# EAGLE design main-stm-02.2 (EAGLE 7.6.0)
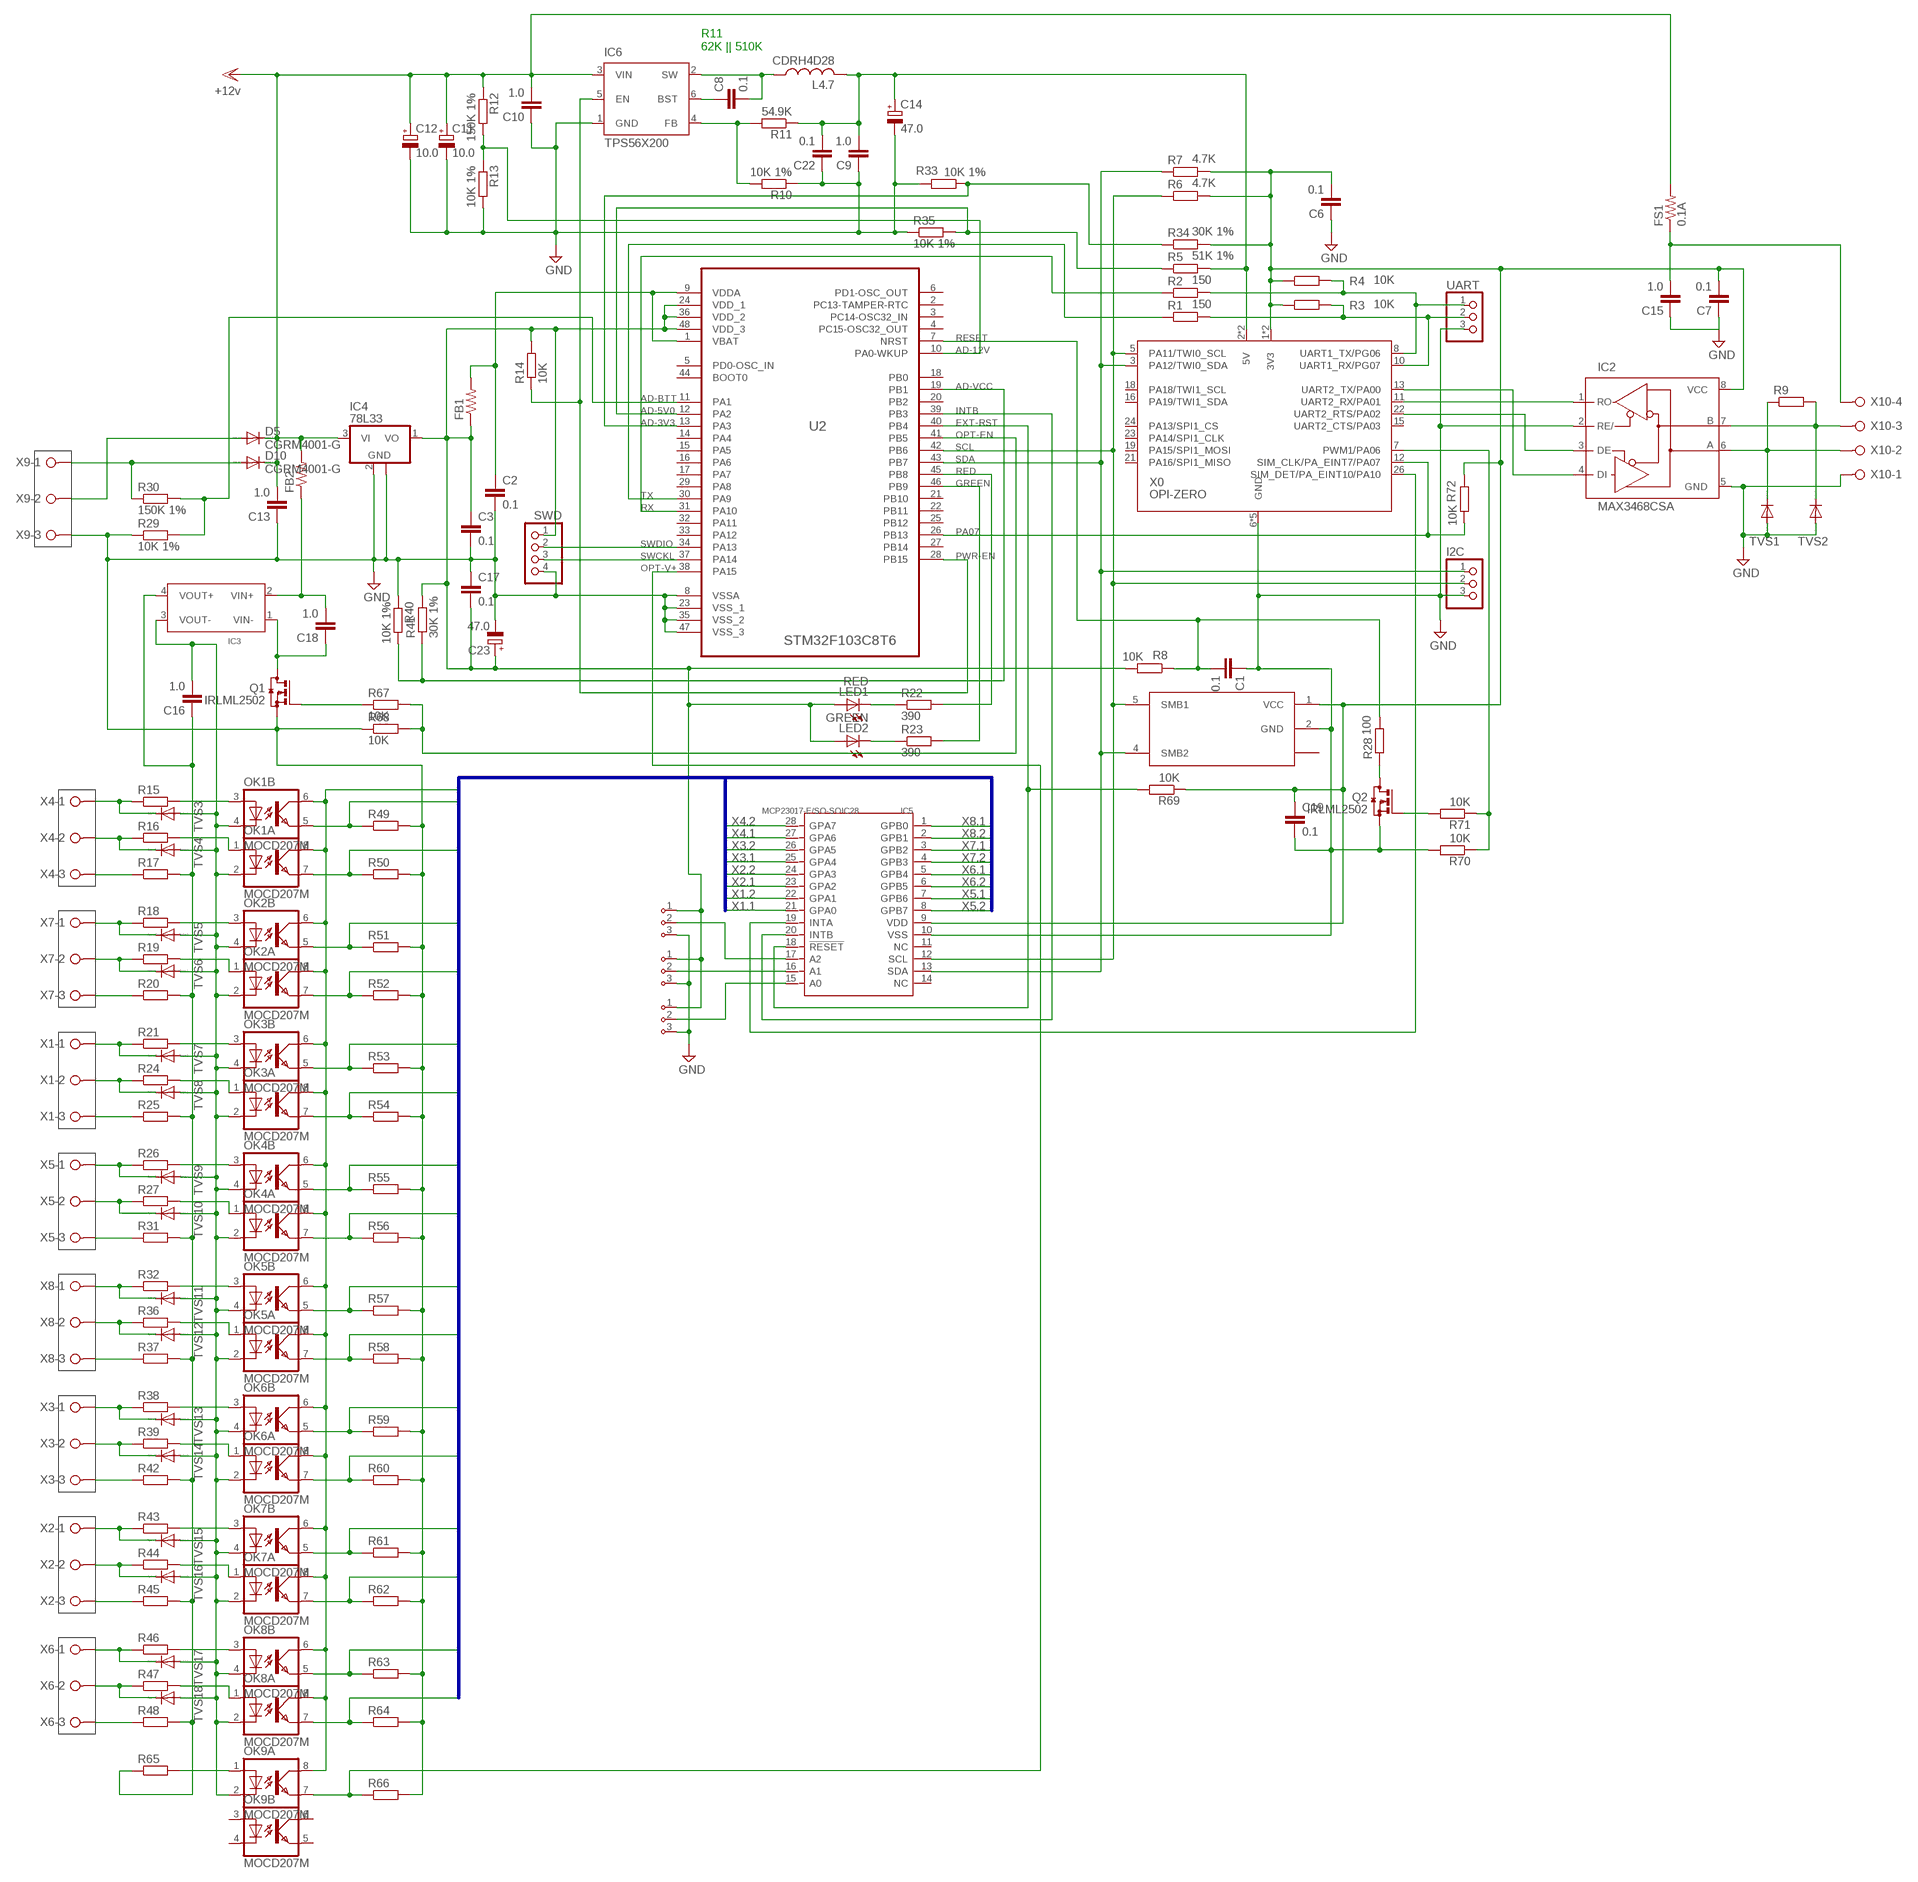
[diagram p0: schematic, sheet 1]

## Parts
A0  ADDR3PIN0603  [0603-3PIN]
A1  ADDR3PIN0603  [0603-3PIN]
A2  ADDR3PIN0603  [0603-3PIN]
C1  0.1  C-EUC0603  [C0603]
C2  0.1  C-EUC0603  [C0603]
C3  0.1  C-EUC0603  [C0603]
C6  0.1  C-EUC0805  [C0805]
C7  0.1  C-EUC0805  [C0805]
C8  0.1  C-EUC0805  [C0805]
C9  1.0  C-EUC0805  [C0805]
C10  1.0  C-EUC1206  [C1206]
C11  10.0  CPOL-EUC/6032-28R  [C/6032-28R]
C12  10.0  CPOL-EUC/6032-28R  [C/6032-28R]
C13  1.0  C-EUC1206  [C1206]
C14  47.0  CPOL-EUB/3528-21R  [B/3528-21R]
C15  1.0  C-EUC1206  [C1206]
C16  1.0  C-EUC1206  [C1206]
C17  0.1  C-EUC0603  [C0603]
C18  1.0  C-EUC1206  [C1206]
C19  0.1  C-EUC0603  [C0603]
C22  0.1  C-EUC0805  [C0805]
C23  47.0  CPOL-EUB/3528-21R  [B/3528-21R]
D5  CGRM4001-G  [SOD-123_MINI-SMA]
D10  CGRM4001-G  [SOD-123_MINI-SMA]
FB1  R-US_R0805  [R0805]
FB2  R-US_R1206  [R1206]
FS1  0.1A  R-US_R1210  [R1210]
I2C  PINHD-1X3  [1X03]
IC2  MAX3468CSA  [SO08]
IC3  DC-DC-CONV-4PIN-ISOLATINGMURATA-NME-05-12-SERIES  [DC-DC-MURATA-NME-05-12-SERIES]
IC4  78L33  78L05F  [SOT89]
IC5  MCP23017-E/SO-SOIC28  INTERFACE-MCP23017-E(SOIC28)  [SOIC28-1.27-17.9X7.5MM]
IC6  TPS56X200  [TSOT23-6_DDC]
IC7  LTC1694  [SOT23-5]
L4.7  CDRH4D28  [CDRH4D28]
LED1  RED  LEDCHIPLED_1206  [CHIPLED_1206]
LED2  GREEN  LEDCHIPLED_1206  [CHIPLED_1206]
OK1  MOCD207M  [SOIC08-FAIRCHILD]
OK2  MOCD207M  [SOIC08-FAIRCHILD]
OK3  MOCD207M  [SOIC08-FAIRCHILD]
OK4  MOCD207M  [SOIC08-FAIRCHILD]
OK5  MOCD207M  [SOIC08-FAIRCHILD]
OK6  MOCD207M  [SOIC08-FAIRCHILD]
OK7  MOCD207M  [SOIC08-FAIRCHILD]
OK8  MOCD207M  [SOIC08-FAIRCHILD]
OK9  MOCD207M  [SOIC08-FAIRCHILD]
Q1  IRLML2502  [SOT23]
Q2  IRLML2502  [SOT23]
R1  150  R-EU_R0603  [R0603]
R2  150  R-EU_R0603  [R0603]
R3  10K  R-EU_R0603  [R0603]
R4  10K  R-EU_R0603  [R0603]
R5  51K 1%  R-EU_R0603  [R0603]
R6  4.7K  R-EU_R0603  [R0603]
R7  4.7K  R-EU_R0603  [R0603]
R8  10K  R-EU_R0603  [R0603]
R9  R-EU_R1206  [R1206]
R10  10K 1%  R-EU_R0603  [R0603]
R11  54.9K  R-EU_R0603  [R0603]
R12  150K 1%  R-EU_R0603  [R0603]
R13  10K 1%  R-EU_R0603  [R0603]
R14  10K  R-EU_R0603  [R0603]
R15  R-EU_R0603  [R0603]
R16  R-EU_R0603  [R0603]
R17  R-EU_R0603  [R0603]
R18  R-EU_R0603  [R0603]
R19  R-EU_R0603  [R0603]
R20  R-EU_R0603  [R0603]
R21  R-EU_R0603  [R0603]
R22  390  R-EU_R0603  [R0603]
R23  390  R-EU_R0603  [R0603]
R24  R-EU_R0603  [R0603]
R25  R-EU_R0603  [R0603]
R26  R-EU_R0603  [R0603]
R27  R-EU_R0603  [R0603]
R28  100  R-EU_R0603  [R0603]
R29  10K 1%  R-EU_R0603  [R0603]
R30  150K 1%  R-EU_R0603  [R0603]
R31  R-EU_R0603  [R0603]
R32  R-EU_R0603  [R0603]
R33  10K 1%  R-EU_R0603  [R0603]
R34  30K 1%  R-EU_R0603  [R0603]
R35  10K 1%  R-EU_R0603  [R0603]
R36  R-EU_R0603  [R0603]
R37  R-EU_R0603  [R0603]
R38  R-EU_R0603  [R0603]
R39  R-EU_R0603  [R0603]
R40  10K 1%  R-EU_R0603  [R0603]
R41  30K 1%  R-EU_R0603  [R0603]
R42  R-EU_R0603  [R0603]
R43  R-EU_R0603  [R0603]
R44  R-EU_R0603  [R0603]
R45  R-EU_R0603  [R0603]
R46  R-EU_R0603  [R0603]
R47  R-EU_R0603  [R0603]
R48  R-EU_R0603  [R0603]
R49  R-EU_R0603  [R0603]
R50  R-EU_R0603  [R0603]
R51  R-EU_R0603  [R0603]
R52  R-EU_R0603  [R0603]
R53  R-EU_R0603  [R0603]
R54  R-EU_R0603  [R0603]
R55  R-EU_R0603  [R0603]
R56  R-EU_R0603  [R0603]
R57  R-EU_R0603  [R0603]
R58  R-EU_R0603  [R0603]
R59  R-EU_R0603  [R0603]
R60  R-EU_R0603  [R0603]
R61  R-EU_R0603  [R0603]
R62  R-EU_R0603  [R0603]
R63  R-EU_R0603  [R0603]
R64  R-EU_R0603  [R0603]
R65  R-EU_R0603  [R0603]
R66  R-EU_R0603  [R0603]
R67  10K  R-EU_R0603  [R0603]
R68  10K  R-EU_R0603  [R0603]
R69  10K  R-EU_R0603  [R0603]
R70  10K  R-EU_R0603  [R0603]
R71  10K  R-EU_R0603  [R0603]
R72  10K  R-EU_R0603  [R0603]
SWD  PINHD-1X4  [1X04]
TVS1  DIODE-SOD323-W  [SOD323-W]
TVS2  DIODE-SOD323-W  [SOD323-W]
TVS3  DIODE-SOD323-W  [SOD323-W]
TVS4  DIODE-SOD323-W  [SOD323-W]
TVS5  DIODE-SOD323-W  [SOD323-W]
TVS6  DIODE-SOD323-W  [SOD323-W]
TVS7  DIODE-SOD323-W  [SOD323-W]
TVS8  DIODE-SOD323-W  [SOD323-W]
TVS9  DIODE-SOD323-W  [SOD323-W]
TVS10  DIODE-SOD323-W  [SOD323-W]
TVS11  DIODE-SOD323-W  [SOD323-W]
TVS12  DIODE-SOD323-W  [SOD323-W]
TVS13  DIODE-SOD323-W  [SOD323-W]
TVS14  DIODE-SOD323-W  [SOD323-W]
TVS15  DIODE-SOD323-W  [SOD323-W]
TVS16  DIODE-SOD323-W  [SOD323-W]
TVS17  DIODE-SOD323-W  [SOD323-W]
TVS18  DIODE-SOD323-W  [SOD323-W]
U2  STM32F103C8T6  STM32F100CBT6B  [QFP50P900X900X160-48N]
UART  PINHD-1X3  [1X03]
X0  OPI-ZERO  [OPI0]
X1  W237-03P  [W237-133]
X2  W237-03P  [W237-133]
X3  W237-03P  [W237-133]
X4  W237-03P  [W237-133]
X5  W237-03P  [W237-133]
X6  W237-03P  [W237-133]
X7  W237-03P  [W237-133]
X8  W237-03P  [W237-133]
X9  W237-03P  [W237-133]
X10  W237-04P  [W237-4P]

## Nets
12V [POWER]: C10.2 C11.+ C12.+ C13.2 D5.C D10.C FB2.2 FS1.2 IC4.3(VI) IC6.3(VIN) R12.1 ; supply symbol labelled +12v
AD-3V3: R33.1 R34.1 U2.13(PA3)
AD-5V0: R5.1 R35.2 U2.12(PA2)
AD-12V: R12.2 R13.1 U2.10(PA0-WKUP)
AD-BTT: R29.2 R30.2 U2.11(PA1)
AD-VCC: R40.2 R41.1 U2.19(PB1)
EXT-RST: IC5.18(!RESET) R69.2 U2.40(PB4)
GND [POWER]: A0.3 A1.3 A2.3 C1.1 C2.2 C3.2 C6.1 C7.1 C9.1 C10.1 C11.- C12.- C13.1 C14.- C15.1 C17.1 C19.2 C22.1 C23.- I2C.3 IC2.2(RE/) IC2.5(GND) IC4.2(GND) IC4.2@1(GND) IC5.10(VSS) IC6.1(GND) IC7.2(GND) Q1.2(S) Q2.2(S) R10.1 R13.2 R29.1 R33.2 R35.1 R40.1 R49.2 R50.2 R51.2 R52.2 R53.2 R54.2 R55.2 R56.2 R57.2 R58.2 R59.2 R60.2 R61.2 R62.2 R63.2 R64.2 R66.2 R68.1 R70.2 SWD.4 TVS1.A TVS2.A U2.8(VSSA) U2.23(VSS_1) U2.35(VSS_2) U2.47(VSS_3) UART.3 X0.6(GND) X0.9(GND) X0.14(GND) X0.20(GND) X0.25(GND) X9.3 X10.1
GREEN: R23.2 U2.46(PB9)
INTA: IC5.19(INTA) X0.26(SIM_DET/PA_EINT10/PA10)
INTB: IC5.20(INTB) U2.39(PB3)
N$1: IC2.3(DE) X0.22(UART2_RTS/PA02)
N$2: IC2.1(RO) X0.11(UART2_RX/PA01)
N$3 [POWER]: C8.2 IC6.2(SW) L4.7.P$1
N$4: Q2.3(D) R28.1
N$5: Q2.1(G) R71.2
N$9: IC2.4(DI) X0.13(UART2_TX/PA00)
N$12 [POWER]: D5.A X9.2
N$14: OK1.3(B:A) R15.2
N$17: C8.1 IC6.6(BST)
N$21: IC2.6(A) R9.1 TVS1.C X10.2
N$22: IC6.4(FB) R10.2 R11.2
N$23: IC2.7(B) R9.2 TVS2.C X10.3
N$24: C15.2 FS1.1 X10.4
N$26: R15.1 TVS3.C X4.1
N$28: R16.1 TVS4.C X4.2
N$30: R17.1 X4.3
N$31 [POWER]: D10.A R30.1 X9.1
N$32: R18.1 TVS5.C X7.1
N$33: R19.1 TVS6.C X7.2
N$34: R20.1 X7.3
N$35: OK2.3(B:A) R18.2
N$36: R21.1 TVS7.C X1.1
N$39: OK3.3(B:A) R21.2
N$40: R24.1 TVS8.C X1.2
N$41: R25.1 X1.3
N$42: R26.1 TVS9.C X5.1
N$43: R27.1 TVS10.C X5.2
N$44: R31.1 X5.3
N$45: R32.1 TVS11.C X8.1
N$46: R36.1 TVS12.C X8.2
N$47: R37.1 X8.3
N$48: R38.1 TVS13.C X3.1
N$49: R39.1 TVS14.C X3.2
N$50: R42.1 X3.3
N$51: R43.1 TVS15.C X2.1
N$52: R44.1 TVS16.C X2.2
N$53: R45.1 X2.3
N$54: R46.1 TVS17.C X6.1
N$55: R47.1 TVS18.C X6.2
N$56: R48.1 X6.3
N$57: OK4.3(B:A) R26.2
N$58: OK5.3(B:A) R32.2
N$59: OK6.3(B:A) R38.2
N$60: OK7.3(B:A) R43.2
N$62: OK8.3(B:A) R46.2
N$63: C16.1 IC3.4(VOUT+) R17.2 R20.2 R25.2 R31.2 R37.2 R42.2 R45.2 R48.2 R65.1
N$65: OK1.1(A:A) R16.2
N$66: OK2.1(A:A) R19.2
N$67: OK3.1(A:A) R24.2
N$69: OK4.1(A:A) R27.2
N$70: OK5.1(A:A) R36.2
N$71: OK6.1(A:A) R39.2
N$72: OK7.1(A:A) R44.2
N$73: OK8.1(A:A) R47.2
N$74: C16.2 IC3.3(VOUT-) OK1.2(A:C) OK1.4(B:C) OK2.2(A:C) OK2.4(B:C) OK3.2(A:C) OK3.4(B:C) OK4.2(A:C) OK4.4(B:C) OK5.2(A:C) OK5.4(B:C) OK6.2(A:C) OK6.4(B:C) OK7.2(A:C) OK7.4(B:C) OK8.2(A:C) OK8.4(B:C) OK9.2(A:C) TVS3.A TVS4.A TVS5.A TVS6.A TVS7.A TVS8.A TVS9.A TVS10.A TVS11.A TVS12.A TVS13.A TVS14.A TVS15.A TVS16.A TVS17.A TVS18.A
N$75: LED1.C R22.1
N$93: OK9.1(A:A) R65.2
N$95: Q1.1(G) R67.1
N$98: C18.1 IC3.1(VIN-) Q1.3(D)
N$99 [POWER]: C18.2 FB2.1 IC3.2(VIN+)
N$116: A0.2 IC5.15(A0)
N$117: A1.2 IC5.16(A1)
N$118: A2.2 IC5.17(A2)
N$119: LED2.C R23.1
OPT-EN: R67.2 R68.2 U2.41(PB5)
OPT-V+: OK9.7(A:EMIT) R66.1 U2.38(PA15)
PA06: R70.1 R71.1 X0.7(PWM1/PA06)
PA07: R72.2 U2.26(PB13) X0.12(SIM_CLK/PA_EINT7/PA07)
PWR-EN: IC6.5(EN) R14.1 U2.28(PB15)
RED: R22.2 U2.45(PB8)
RESET: C1.2 R8.1 R28.2 U2.7(NRST)
RX: R2.1 U2.31(PA10)
SCL: I2C.2 IC5.12(SCL) IC7.5(SMB1) R6.1 U2.42(PB6) X0.5(PA11/TWI0_SCL)
SDA: I2C.1 IC5.13(SDA) IC7.4(SMB2) R7.1 U2.43(PB7) X0.3(PA12/TWI0_SDA)
SWCKL: SWD.3 U2.37(PA14)
SWDIO: SWD.2 U2.34(PA13)
TX: R1.1 U2.30(PA9)
VCC [POWER]: A0.1 A1.1 A2.1 C3.1 C17.2 C23.+ FB1.1 IC4.1(VO) LED1.A LED2.A R8.2 R14.2 R41.2 SWD.1 U2.24(VDD_1) U2.36(VDD_2) U2.48(VDD_3)
VDDA: C2.1 FB1.2 U2.1(VBAT) U2.9(VDDA)
X1.1: IC5.21(GPA0) OK3.5(B:EMIT) R53.1
X1.2: IC5.22(GPA1) OK3.7(A:EMIT) R54.1
X2.1: IC5.23(GPA2) OK7.5(B:EMIT) R61.1
X2.2: IC5.24(GPA3) OK7.7(A:EMIT) R62.1
X3.1: IC5.25(GPA4) OK6.5(B:EMIT) R59.1
X3.2: IC5.26(GPA5) OK6.7(A:EMIT) R60.1
X4.1: IC5.27(GPA6) OK1.5(B:EMIT) R49.1
X4.2: IC5.28(GPA7) OK1.7(A:EMIT) R50.1
X5.1: IC5.7(GPB6) OK4.5(B:EMIT) R55.1
X5.2: IC5.8(GPB7) OK4.7(A:EMIT) R56.1
X6.1: IC5.5(GPB4) OK8.5(B:EMIT) R63.1
X6.2: IC5.6(GPB5) OK8.7(A:EMIT) R64.1
X7.1: IC5.3(GPB2) OK2.5(B:EMIT) R51.1
X7.2: IC5.4(GPB3) OK2.7(A:EMIT) R52.1
X8.1: IC5.1(GPB0) OK5.5(B:EMIT) R57.1
X8.2: IC5.2(GPB1) OK5.7(A:EMIT) R58.1
Z3V3 [POWER]: C6.2 C7.2 C19.1 IC2.8(VCC) IC5.9(VDD) IC7.1(VCC) OK1.6(B:COL) OK1.8(A:COL) OK2.6(B:COL) OK2.8(A:COL) OK3.6(B:COL) OK3.8(A:COL) OK4.6(B:COL) OK4.8(A:COL) OK5.6(B:COL) OK5.8(A:COL) OK6.6(B:COL) OK6.8(A:COL) OK7.6(B:COL) OK7.8(A:COL) OK8.6(B:COL) OK8.8(A:COL) OK9.8(A:COL) R3.1 R4.1 R6.2 R7.2 R34.2 R69.1 R72.1 X0.1(3V3) X0.17(3V3)
Z5V [POWER]: C9.2 C14.+ C22.2 L4.7.P$2 R5.2 R11.1 X0.2(5V) X0.4(5V)
ZRX: R1.2 R3.2 UART.2 X0.10(UART1_RX/PG07)
ZTX: R2.2 R4.2 UART.1 X0.8(UART1_TX/PG06)
Unconnected: IC5.11(NC) IC5.14(NC) IC7.3(NC) OK9.3(B:A) OK9.4(B:C) OK9.5(B:EMIT) OK9.6(B:COL) U2.2(PC13-TAMPER-RTC) U2.3(PC14-OSC32_IN) U2.4(PC15-OSC32_OUT) U2.5(PD0-OSC_IN) U2.6(PD1-OSC_OUT) U2.14(PA4) U2.15(PA5) U2.16(PA6) U2.17(PA7) U2.18(PB0) U2.20(PB2) U2.21(PB10) U2.22(PB11) U2.25(PB12) U2.27(PB14) U2.29(PA8) U2.32(PA11) U2.33(PA12) U2.44(BOOT0) X0.15(UART2_CTS/PA03) X0.16(PA19/TWI1_SDA) X0.18(PA18/TWI1_SCL) X0.19(PA15/SPI1_MOSI) X0.21(PA16/SPI1_MISO) X0.23(PA14/SPI1_CLK) X0.24(PA13/SPI1_CS)

## Buses
B$1

## Notes on the sheet
- R11
  62K || 510K

## Library data of the parts
A0 A1 A2 = components:ADDR3PIN
C1-C3 C6-C10 C13 C15-C19 C22 = rcl:C-EU: CAPACITOR, European symbol
C11 C12 C14 C23 = rcl:CPOL-EU: POLARIZED CAPACITOR, European symbol
D5 D10 = diode:CGRM400*-G: Molded plasitc,JEDEC SOD-123/Mini SMA Source: Comchip CGRM4001-G.pdf
FB1 FB2 FS1 = rcl:R-US_: RESISTOR, American symbol
I2C UART = pinhead:PINHD-1X3: PIN HEADER
IC2 = maxim:MAX34*: +5V, Fail-Safe, 40Mbps, Profibus RS-485/RS-422 Transceivers Source: MAX3465-MAX3469.pdf; MPN: MAX3468CSA+; OC_FARNELL: unknown; OC_NEWARK: 76K6721
IC3 = SteveMarple:DC-DC-CONV-4PIN-ISOLATING
IC4 = linear:78L*: POSITOIV-VOLTAGE REGULATORS Output up to 100 mA Source: Datasheet <http://focus.ti.com/lit/ds/symlink/ua78l05.pdf>
IC5 = Seeed-OPL-ic:INTERFACE-MCP23017-E(SOIC28): 310070050; MPN: MCP23017-E/SO
IC6 = custom:TPS56X200
IC7 = components:LTC1694: Dual SMBus active pull-up
L4.7 = custom:CDRH4D28
LED1 LED2 = led:LED: LED OSRAM: - CHIPLED LG R971, LG N971, LY N971, LG Q971, LY Q971, LO R971, LY R971 LH N974, LH R974 LS Q976, LO Q976, LY Q976 LO Q996 - Hyper CHIPLED LW Q18S LB Q993, LB Q99A, LB R99A - SideLED LS A670, LO A670, LY A670, LG A670, LP A670 LB A673, LV A673, LT A673, LW A673 LH A674 LY A675 LS A676, LA A676, LO A676, LY A676, LW A676 LS A679, LY A679, LG A679 - Hyper Micro SIDELED® LS Y876, LA Y876, LO Y876, LY Y876 LT Y87S - SmartLED LW L88C, LW L88S LB L89C, LB L89S, LG L890 LS L89K, LO L89K, LY L89K LS L896, LA L896, LO L896, LY L896 - TOPLED LS T670, LO T670, LY T670, LG T670, LP T670 LSG T670, LSP T670, LSY T670, LOP T670, LYG T670 LG T671, LOG T671, LSG T671 LB T673, LV T673, LT T673, LW T673 LH T674 LS T676, LA T676, LO T676, LY T676, LB T676, LH T676, LSB T676, LW T676 LB T67C, LV T67C, LT T67C, LS T67K, LO T67K, LY T67K, LW E67C LS E67B, LA E67B, LO E67B, LY E67B, LB E67C, LV E67C, LT E67C LW T67C LS T679, LY T679, LG T679 LS T770, LO T770, LY T770, LG T770, LP T770 LB T773, LV T773, LT T773, LW T773 LH T774 LS E675, LA E675, LY E675, LS T675 LS T776, LA T776, LO T776, LY T776, LB T776 LHGB T686 LT T68C, LB T68C - Hyper Mini TOPLED® LB M676 - Mini TOPLED Santana® LG M470 LS M47K, LO M47K, LY M47K Source: http://www.osram.convergy.de LUXEON: - LUMILED® LXK2-PW12-R00, LXK2-PW12-S00, LXK2-PW14-U00, LXK2-PW14-V00 LXK2-PM12-R00, LXK2-PM12-S00, LXK2-PM14-U00 LXK2-PE12-Q00, LXK2-PE12-R00, LXK2-PE12-S00, LXK2-PE14-T00, LXK2-PE14-U00 LXK2-PB12-K00, LXK2-PB12-L00, LXK2-PB12-M00, LXK2-PB14-N00, LXK2-PB14-P00, LXK2-PB14-Q00 LXK2-PR12-L00, LXK2-PR12-M00, LXK2-PR14-Q00, LXK2-PR14-R00 LXK2-PD12-Q00, LXK2-PD12-R00, LXK2-PD12-S00 LXK2-PH12-R00, LXK2-PH12-S00 LXK2-PL12-P00, LXK2-PL12-Q00, LXK2-PL12-R00 Source: www.luxeon.com KINGBRIGHT: KA-3528ASYC Source: www.kingbright.com
OK1-OK9 = optocoupler:MOCD20*M: MOCD207M, MOCD208M Dual Channel Phototransistor Small Outline Surface Mount Optocouplers Source: Data sheet <http://www.fairchildsemi.com/ds/MO%2FMOCD207-M.pdf>; MF: FAIRCHILD SEMICONDUCTOR; MPN: MOCD207-M; OC_FARNELL: 1623297; OC_NEWARK: 67K0803
Q1 Q2 = components:IRLML2502: N-CHANNEL MOS FET
R1-R72 = rcl:R-EU_: RESISTOR, European symbol
SWD = pinhead:PINHD-1X4: PIN HEADER
TVS1-TVS18 = diode:DIODE-: DIODE
U2 = ST Microelctronics_By_element14_Batch_1:STM32F100CBT6B: ARM-based 32-bit MCU; MPN: STM32F100CBT6B; OC_FARNELL: 1838512; OC_NEWARK: 86R1308; PACKAGE: LQFP-48; SUPPLIER: STMircroelectronics
X0 = OrangePi0:OPI-ZERO: Orange Pi Zero Footprint. Only 2x13 pin header. -- UNTESTED!
X1-X9 = con-wago-508:W237-03P: WAGO SREW CLAMP; OC_FARNELL: unknown; OC_NEWARK: unknown
X10 = con-wago-508:W237-04P: WAGO SREW CLAMP; OC_FARNELL: unknown; OC_NEWARK: unknown

## Net classes
0 default: width 0.254 mm, clearance 0.254 mm
1 POWER: width 0.508 mm, clearance 0.254 mm
2 HV: width 1.27 mm, clearance 1.27 mm

## Board
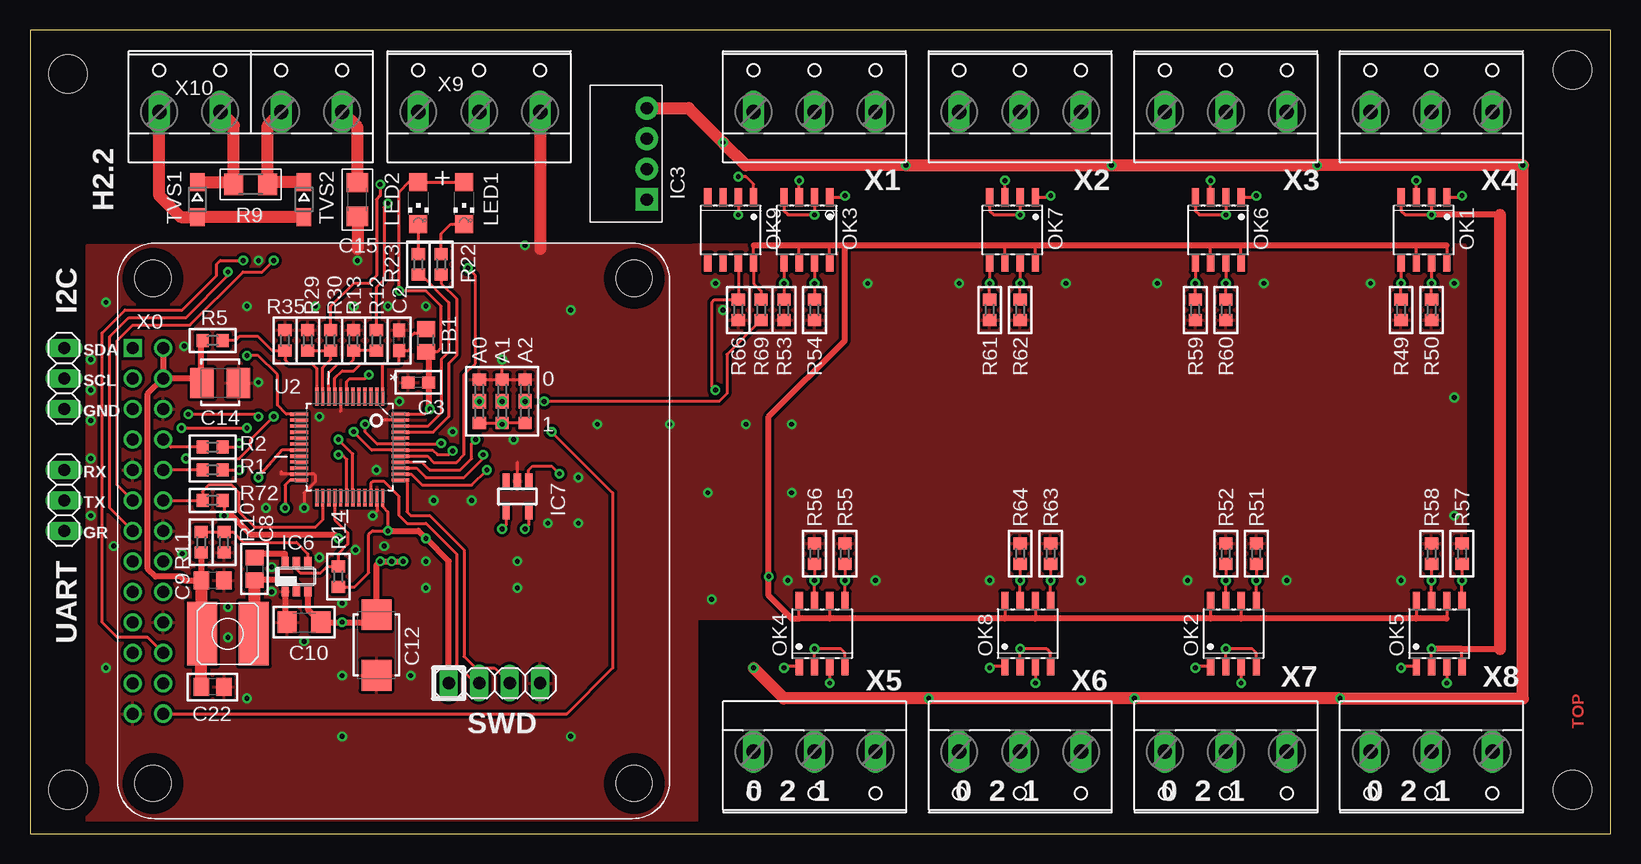
[diagram p1: board, top side]
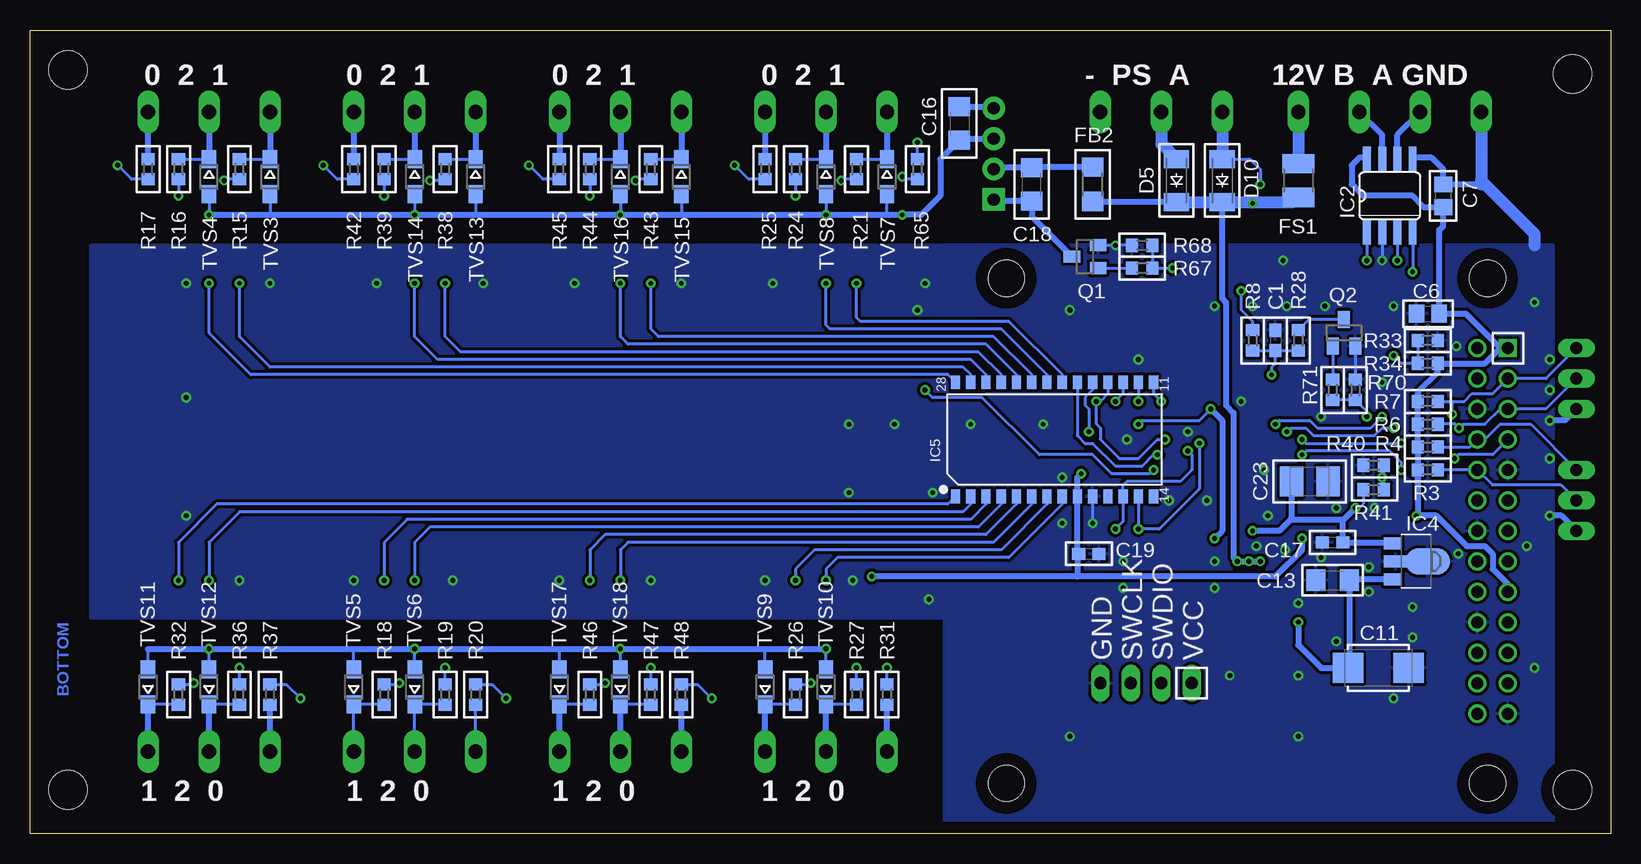
[diagram p2: board, bottom side, seen from below]

Size 131.75 x 67.04 mm. Coordinates in mm from the lower left corner, seen from the top.
Outline: 131.75,0 131.75,67.04 0,67.04 0,0 131.75,0
Copper layers (1*16): Top 0.035mm / dielectric 1.5mm / Bottom 0.035mm
Design rules "default *": minimum track width 10mil, minimum drill 15mil, track to track 4mil, track to pad 4mil, pad to pad 4mil, via to via 8mil, smd to smd 4mil, copper to edge 40mil, drill to drill 10mil, minimum pad ring 10mil, minimum via ring 8mil, stop-mask expansion 4mil, vias tented up to drill 20mil, thermal gap 10mil
Holes 3.2 mm at 3.16,63.37 128.58,63.69 128.58,3.68 3.16,3.68

### Footprints (pad centres in the part's own frame; a part is rotated, then mirrored left to right if it is on the bottom)
0603-3PIN = smd 1 x 1.1: 1 -0.85,1.27; 3 2.755,1.27 | smd 1.227 x 1.1: 2 0.954,1.27
C0603 = smd 1.1 x 1: 1 -0.85,0; 2 0.85,0
C0805 = smd 1.3 x 1.5: 1 -0.95,0; 2 0.95,0
C1206 = smd 1.6 x 1.8: 1 -1.4,0; 2 1.4,0
C/6032-28R = smd 2.55 x 2.5: + 2.525,0; - -2.525,0
B/3528-21R = smd 1.95 x 2.5: + 1.525,0; - -1.525,0
SOD-123_MINI-SMA = smd 1.5 x 2.1: A 1.8,0; C -1.8,0
R0805 = smd 1.3 x 1.5: 1 -0.95,0; 2 0.95,0
R1206 = smd 1.6 x 1.803: 1 -1.422,0; 2 1.422,0
R1210 = smd 1.6 x 2.7: 1 -1.4,0; 2 1.4,0
1X03 = drill 1.016 long: 1 -2.54,0; 2 0,0; 3 2.54,0
SO08 = smd 0.66 x 2.032: 1 -1.905,-3.073; 2 -0.635,-3.073; 3 0.635,-3.073; 4 1.905,-3.073; 5 1.905,3.073; 6 0.635,3.073; 7 -0.635,3.073; 8 -1.905,3.073
DC-DC-MURATA-NME-05-12-SERIES = drill 1.016 pad 1.88 square: 1 -3.81,0 | drill 1.016 pad 1.88: 2 -1.27,0; 3 1.27,0; 4 3.81,0
SOT89 = smd 1 x 1.5: 1 -1.499,-1.981; 3 1.499,-1.981 | smd 1 x 2: 2 0,-1.727 | smd 2.2 x 3.7: 2@1 0,0.94
SOIC28-1.27-17.9X7.5MM = smd 0.762 x 1.143: 1 -8.255,-4.75; 2 -6.985,-4.75; 3 -5.715,-4.75; 4 -4.445,-4.75; 5 -3.175,-4.75; 6 -1.905,-4.75; 7 -0.635,-4.75; 8 0.635,-4.75; 9 1.905,-4.75; 10 3.175,-4.75; 11 4.445,-4.75; 12 5.715,-4.75; 13 6.985,-4.75; 14 8.255,-4.75; 15 8.255,4.775; 16 6.985,4.775; 17 5.715,4.775; 18 4.445,4.775; 19 3.175,4.775; 20 1.905,4.775; 21 0.635,4.775; 22 -0.635,4.775; 23 -1.905,4.775; 24 -3.175,4.775; 25 -4.445,4.775; 26 -5.715,4.775; 27 -6.985,4.775; 28 -8.255,4.775
TSOT23-6_DDC = smd 0.6 x 0.8: 1 -0.95,-1.25; 2 0,-1.25; 3 0.95,-1.25; 4 0.95,1.25; 5 0,1.25; 6 -0.95,1.25
SOT23-5 = smd 0.6 x 1.2: 1 -0.95,-1.306; 2 0,-1.306; 3 0.95,-1.306; 4 0.95,1.306; 5 -0.95,1.306
CDRH4D28 = smd 2.5 x 5.3: P$1 -2.159,0; P$2 2.159,0
CHIPLED_1206 = smd 1.5 x 1.5: A 0,-1.75; C 0,1.75
SOIC08-FAIRCHILD = smd 0.61 x 1.52: 1 -1.905,-2.723; 2 -0.635,-2.723; 3 0.635,-2.723; 4 1.905,-2.723; 5 1.905,2.723; 6 0.635,2.723; 7 -0.635,2.723; 8 -1.905,2.723
SOT23 = smd 1 x 1.4: 1 -0.95,-1.1; 2 0.95,-1.1; 3 0,1.1
R0603 = smd 1 x 1.1: 1 -0.85,0; 2 0.85,0
1X04 = drill 1.016 long: 1 -3.81,0; 2 -1.27,0; 3 1.27,0; 4 3.81,0
SOD323-W = smd 1.5 x 1.2: A 1.45,0; C -1.45,0
QFP50P900X900X160-48N = smd 1.473 x 0.279: 1 -4.216,2.743; 2 -4.216,2.261; 3 -4.216,1.753; 4 -4.216,1.245; 5 -4.216,0.762; 6 -4.216,0.254; 7 -4.216,-0.254; 8 -4.216,-0.762; 9 -4.216,-1.245; 10 -4.216,-1.753; 11 -4.216,-2.261; 12 -4.216,-2.743; 25 4.216,-2.743; 26 4.216,-2.261; 27 4.216,-1.753; 28 4.216,-1.245; 29 4.216,-0.762; 30 4.216,-0.254; 31 4.216,0.254; 32 4.216,0.762; 33 4.216,1.245; 34 4.216,1.753; 35 4.216,2.261; 36 4.216,2.743 | smd 0.279 x 1.473: 13 -2.743,-4.216; 14 -2.261,-4.216; 15 -1.753,-4.216; 16 -1.245,-4.216; 17 -0.762,-4.216; 18 -0.254,-4.216; 19 0.254,-4.216; 20 0.762,-4.216; 21 1.245,-4.216; 22 1.753,-4.216; 23 2.261,-4.216; 24 2.743,-4.216; 37 2.743,4.216; 38 2.261,4.216; 39 1.753,4.216; 40 1.245,4.216; 41 0.762,4.216; 42 0.254,4.216; 43 -0.254,4.216; 44 -0.762,4.216; 45 -1.245,4.216; 46 -1.753,4.216; 47 -2.261,4.216; 48 -2.743,4.216
OPI0 = drill 1 square: 1 0,0 | drill 1: 2 0,2.54; 3 2.54,0; 4 2.54,2.54; 5 5.08,0; 6 5.08,2.54; 7 7.62,0; 8 7.62,2.54; 9 10.16,0; 10 10.16,2.54; 11 12.7,0; 12 12.7,2.54; 13 15.24,0; 14 15.24,2.54; 15 17.78,0; 16 17.78,2.54; 17 20.32,0; 18 20.32,2.54; 19 22.86,0; 20 22.86,2.54; 21 25.4,0; 22 25.4,2.54; 23 27.94,0; 24 27.94,2.54; 25 30.48,0; 26 30.48,2.54 | hole 3: -5.815,1.694; 36.295,1.694; 36.295,41.805; -5.815,41.805
W237-133 = drill 1.194 long: 1 -5.08,-0.635; 2 0,-0.635; 3 5.08,-0.635
W237-4P = drill 1.194 long: 1 -7.62,-0.635; 2 -2.54,-0.635; 3 2.54,-0.635; 4 7.62,-0.635

### Placement (x,y rotation side)
A0  38.72,35.12 90 top
A1  40.63,35.12 90 top
A2  42.53,35.12 90 top
C1  27.93,41.15 270 bottom
C2  30.78,41.15 90 top
C3  32.37,37.66 180 top
C6  15.23,43.37 0 bottom
C7  13.96,53.21 270 bottom
C8  18.72,22.1 270 top
C9  15.23,21.15 180 top
C10  22.85,17.65 0 top
C11  19.35,13.84 180 bottom
C12  28.88,15.75 90 top
C13  23.16,21.15 0 bottom
C14  15.86,37.6 180 top
C15  27.29,52.9 90 top
C16  54.28,59.25 270 bottom
C17  23.16,24.32 0 bottom
C18  48.25,54.17 90 bottom
C19  43.48,23.37 0 bottom
C22  15.23,12.26 180 top
C23  25.07,29.4 180 bottom
D5  36.18,54.48 90 bottom
D10  32.37,54.48 90 bottom
FB1  33.01,41.15 90 top
FB2  43.17,54.17 270 bottom
FS1  26.02,54.48 270 bottom
I2C  2.85,37.97 270 top
IC2  18.4,53.21 0 bottom
IC3  51.42,56.71 90 top
IC4  16.18,22.73 270 bottom
IC5  46.34,32.89 0 bottom
IC6  22.21,21.46 0 top
IC7  40.63,28.13 180 top
L4.7  16.5,16.7 180 top
LED1  36.18,52.58 180 top
LED2  32.37,52.58 180 top
OK1  116.19,50.36 180 top
OK2  100.32,16.7 0 top
OK3  64.76,50.36 180 top
OK4  66.03,16.7 0 top
OK5  117.46,16.7 0 top
OK6  99.05,50.36 180 top
OK7  81.9,50.36 180 top
OK8  83.17,16.7 0 top
OK9  58.41,50.36 180 top
Q1  43.8,48.13 90 bottom
Q2  22.21,41.78 0 bottom
R1  15.23,30.35 180 top
R2  15.23,32.26 180 top
R3  15.23,30.35 0 bottom
R4  15.23,32.26 0 bottom
R5  15.23,41.15 180 top
R6  15.23,34.16 180 bottom
R7  15.23,36.07 180 bottom
R8  29.83,41.15 90 bottom
R9  18.4,54.17 0 top
R10  16.18,24.32 90 top
R11  14.28,24.32 90 top
R12  28.88,41.15 270 top
R13  26.98,41.15 90 top
R14  25.7,21.46 270 top
R15  114.29,55.44 270 bottom
R16  119.37,55.44 270 bottom
R17  121.91,55.44 270 bottom
R18  102.22,11.62 90 bottom
R19  97.14,11.62 90 bottom
R20  94.6,11.62 90 bottom
R21  62.85,55.44 270 bottom
R22  34.28,47.5 270 top
R23  32.37,47.5 270 top
R24  67.93,55.44 270 bottom
R25  70.47,55.44 270 bottom
R26  67.93,11.62 90 bottom
R27  62.85,11.62 90 bottom
R28  26.02,41.15 270 bottom
R29  23.16,41.15 270 top
R30  25.06,41.15 270 top
R31  60.31,11.62 90 bottom
R32  119.37,11.62 90 bottom
R33  15.23,41.15 0 bottom
R34  15.23,39.24 0 bottom
R35  21.25,41.15 270 top
R36  114.29,11.62 90 bottom
R37  111.75,11.62 90 bottom
R38  97.14,55.44 270 bottom
R39  102.22,55.44 270 bottom
R40  19.74,30.74 0 bottom
R41  19.74,28.7 180 bottom
R42  104.76,55.44 270 bottom
R43  80,55.44 270 bottom
R44  85.08,55.44 270 bottom
R45  87.62,55.44 270 bottom
R46  85.08,11.62 90 bottom
R47  80,11.62 90 bottom
R48  77.46,11.62 90 bottom
R49  114.29,43.69 270 top
R50  116.83,43.69 270 top
R51  102.22,23.37 90 top
R52  99.68,23.37 90 top
R53  62.85,43.69 270 top
R54  65.39,43.69 270 top
R55  67.93,23.37 90 top
R56  65.39,23.37 90 top
R57  119.37,23.37 90 top
R58  116.83,23.37 90 top
R59  97.14,43.69 270 top
R60  99.68,43.69 270 top
R61  80,43.69 270 top
R62  82.54,43.69 270 top
R63  85.08,23.37 90 top
R64  82.54,23.37 90 top
R65  57.77,55.44 270 bottom
R66  59.04,43.69 270 top
R67  39.04,47.18 0 bottom
R68  39.04,49.09 0 bottom
R69  60.95,43.69 270 top
R70  21.26,37.02 90 bottom
R71  23.16,37.02 90 bottom
R72  15.23,27.81 180 top
SWD  38.72,12.57 0 top
TVS1  13.96,52.9 270 top
TVS2  22.85,52.9 270 top
TVS3  111.75,54.8 270 bottom
TVS4  116.83,54.8 270 bottom
TVS5  104.76,12.26 90 bottom
TVS6  99.68,12.26 90 bottom
TVS7  60.31,54.8 270 bottom
TVS8  65.39,54.8 270 bottom
TVS9  70.47,12.26 90 bottom
TVS10  65.39,12.26 90 bottom
TVS11  121.91,12.26 90 bottom
TVS12  116.83,12.26 90 bottom
TVS13  94.6,54.8 270 bottom
TVS14  99.68,54.8 270 bottom
TVS15  77.46,54.8 270 bottom
TVS16  82.54,54.8 270 bottom
TVS17  87.62,12.26 90 bottom
TVS18  82.54,12.26 90 bottom
U2  26.66,32.26 270 top
UART  2.85,27.81 270 top
X0  8.56,40.51 270 top
X1  65.39,60.83 0 top
X2  82.54,60.83 0 top
X3  99.68,60.83 0 top
X4  116.83,60.83 0 top
X5  65.39,6.22 180 top
X6  82.54,6.22 180 top
X7  99.68,6.22 180 top
X8  116.83,6.22 180 top
X9  37.45,60.83 0 top
X10  18.4,60.83 0 top

### Tracks (layer width: path | path; a pad name or v marks a point on that pad's centre or on a via)
12V  (via drill 0.4)
  Top 0.254: R12.1 28.88,45.59 29.51,46.23 29.51,52.26 v29.83,52.58
  Top 0.508: 23.17,20.19 23.16,20.19 23.23,20.19 IC6.3 23.16,18.74 C10.2 v26.02,17.65 28.55,17.65 28.88,17.99 C12.+ 28.88,22.42 v29.2,22.73 v31.1,22.73
  Bottom 0.254: D10.C 32.27,52.58 v29.83,52.58
  Bottom 0.508: FB2.2 36.24,52.74 D5.C | IC4.3 21.68,21.23 C13.2 21.76,13.96 C11.+ 24.12,13.84 26.02,15.75 v26.02,17.65 | 26.42,52.68 26.42,53.08 FS1.2 | D10.C 32.37,44.64 32.06,44.32 32.06,35.75 31.42,35.11 31.42,23.05 v31.1,22.73 v29.2,22.73
  Bottom 1.016: D5.C D10.C 26.42,52.68
AD-3V3  (via drill 0.4)
  Top 0.254: U2.13 21.37,35 20.63,35.75 20.63,38.29 19.04,39.88 v18.08,39.88
  Bottom 0.254: R34.1 16.05,39.24 | R33.1 R34.1 | R34.1 17.45,39.24 v18.08,39.88
AD-5V0
  Top 0.254: U2.12 23.91,38.81 23.48,39.24 21.58,39.24 21.25,39.57 R35.2 20.2,40.3 19.04,41.47 17.45,41.47 17.13,41.15 R5.1
AD-12V
  Top 0.254: R12.2 R13.1 26.97,39.56 26.66,39.24 25.7,39.24 24.9,38.44 U2.10
AD-BTT
  Top 0.254: 25.14,40.22 R30.2 | R29.2 R30.2 | U2.11 24.4,38.89 25.07,39.56 R30.2
AD-VCC  (via drill 0.4)
  Top 0.254: U2.19 21.01,32 v19.04,29.72
  Bottom 0.254: R41.1 18.89,29.72 | 18.89,29.72 R40.2 | v19.04,29.72 18.89,29.72
EXT-RST  (via drill 0.4)
  Top 0.254: R69.2 58.09,39.98 58.09,36.7 57.45,36.07 v42.85,36.07 | U2.40 32.66,31.01 33.33,30.35 35.86,30.35 36.82,31.31 36.82,32.58 v37.13,32.89
  Bottom 0.254: IC5.18 41.9,36.7 42.53,36.07 v42.85,36.07 42.85,34.16 42.53,33.84 42.53,32.89 40.95,31.31 39.36,31.31 37.77,32.89 v37.13,32.89
GND  (via drill 0.4)
  Top 0.254: A0.3 A1.3 | A1.3 A2.3 | A1.3 v39.36,39.56 | R29.1 | IC7.2 40.63,30.99 | v22.85,27.18 22.85,28.45 23.8,29.4 23.8,29.88 23.68,30 U2.23 20.94,30 20.94,30.19 | U2.8 25.9,35.24 | U2.47 29.55,34.52 | U2.35 28.92,26.9 | 21.3,30 21.26,30.04
  Top 0.508: IC6.1 21.26,17.84 C10.1 | 22.9,51.5 TVS2.A
  Top 1.016: C15.1 27.29,48.77 | X9.3 42.53,48.77 | TVS2.A TVS1.A 12.55,51.45 10.78,53.21 X10.1
  Bottom 0.254: IC5.10 v43.17,25.91 | IC2.2 v19.04,47.82 | R68.1 v41.26,49.09 v41.27,49.08 Q1.2 | Q2.2 21.26,40.04 R70.2
  Bottom 0.508: IC2.5 16.4,56.39 14.91,56.39 13.96,55.43 C7.1 11.1,54.16 | 11.1,54.16 10.79,54.16 | UART.3 4.12,26.54 4.91,26.54 5.07,26.38 | I2C.3 3.8,34.48 v5.07,34.48 | 10.78,54.48 11.1,54.16
  Bottom 1.016: 6.34,49.09 6.34,50.04 10.46,54.16 10.79,54.16 | X10.1 10.78,54.48
  other vias: 118.73,26.54 53.33,34.16 57.14,45.91 6.34,44.32 12.85,40.67 57.77,43.69 26.02,13.21 31.74,13.21 6.34,13.84 26.02,8.13 45.07,8.13 56.82,19.56 63.49,34.16 69.84,45.91 77.46,45.91 86.35,45.91 93.97,45.91 102.86,45.91 111.75,45.91 118.73,45.91 70.47,21.15 80,21.15 87.62,21.15 96.51,21.15 104.76,21.15 114.29,21.15 63.17,21.15 16.5,18.92 16.5,16.38 18.09,11.3 26.02,19.24 20.15,22.26 6.97,24 12.69,23.37 45.07,43.69 18.09,44.01 56.5,28.45 63.49,28.45 59.68,34.16 118.73,36.39 30.78,36.07 29.83,44.01 26.98,44.01 28.88,30.35 5.07,31.31 5.07,37.02 5.07,39.56 5.07,26.54 47.3,34.16 45.71,25.91 45.71,29.72 33.01,44.01 36.82,27.81 40.63,20.51 33.01,20.51 19.67,27.18 35.23,33.53 40.31,32.89 33.01,22.73 40.63,22.73 24.12,23.05 28.56,26.54 29.52,24 33.64,27.81 19.04,37.66 27.13,23.69 20.15,20.19 22.85,16.07 24.12,34.8 23.8,44.01 27.29,47.82
  pour Bottom: 4.75,0.83 4.75,49.09 55.55,49.09 55.55,0.83
  pour Top: 4.75,0.83 4.75,49.09 55.55,49.09 55.55,0.83
  pour Bottom: 55.23,49.09 55.23,17.97 126.67,17.97 126.67,49.09
  pour Top: 55.23,49.09 55.23,17.97 119.69,17.97 119.69,49.09
GREEN
  Top 0.254: R23.2 32.59,46.65 34.91,44.32 34.91,40.2 34.28,39.56 34.28,35.11 33.17,34.01 U2.46
INTA  (via drill 0.4)
  Top 0.254: X0.26 44.75,10.03 48.56,13.84 48.56,28.45 v43.49,33.53
  Bottom 0.254: IC5.19 43.17,37.02 43.8,36.39 43.8,35.75 43.49,35.43 v43.49,33.53
INTB  (via drill 0.4)
  Top 0.254: U2.39 32.22,30.51 33.01,29.72 36.18,29.72 37.77,31.31 v37.77,31.62
  Bottom 0.254: IC5.20 44.44,33.21 43.8,32.58 43.17,32.58 41.26,30.67 39.04,30.67 38.09,31.62 v37.77,31.62
N$1  (via drill 0.4)
  Top 0.254: X0.22 9.83,16.38 7.29,16.38 6.02,17.65 6.02,41.78 7.92,43.69 12.69,43.69 15.54,46.54 15.54,47.5 15.86,47.82 v17.77,47.82
  Bottom 0.254: IC2.3 v17.77,47.82
N$2  (via drill 0.4)
  Top 0.254: X0.11 7.29,29.08 7.29,41.15 8.56,42.42 13.32,42.42 17.77,46.86 19.35,46.86 v20.31,47.82
  Bottom 0.254: IC2.1 v20.31,47.82
N$3
  Top 0.508: IC6.2 22.21,20.7 21.7,21.21 18.72,21.21 C8.2
  Top 1.016: L4.7.P$1 18.72,16.95 C8.2
N$4
  Bottom 0.254: Q2.3 25.14,42.88 R28.1
N$5
  Bottom 0.254: Q2.1 23.17,40.04 R71.2
N$6  (via drill 0.4)
  other vias: 30.15,22.73
N$9  (via drill 0.4)
  Top 0.254: X0.13 6.66,27.18 6.66,41.47 8.24,43.05 13.01,43.05 16.5,46.54 v16.5,46.86
  Bottom 0.254: IC2.4 v16.5,46.86
N$12
  Bottom 1.016: X9.2 37.45,57.55 D5.A
N$14  (via drill 0.4)
  Top 0.254: OK1.3 v115.56,54.48
  Bottom 0.254: R15.2 115.45,54.59 v115.56,54.48
N$17
  Top 0.254: IC6.6 | 18.72,23.37 C8.1
  Top 0.508: IC6.6 21.26,23.37 18.72,23.37
N$21
  Top 0.508: 16.8,54.34 R9.1
  Top 1.016: R9.1 16.98,59.08 X10.2 | TVS1.C 16.8,54.34
  Bottom 0.508: IC2.6 17.77,58.29 X10.2
N$22
  Top 0.254: 23.17,22.73 IC6.4 23.17,23.37 22.21,24.32 17.77,24.32 16.92,25.17 R10.2 R11.2
N$23
  Top 0.508: 20,54.34 R9.2
  Top 1.016: R9.2 19.82,59.08 X10.3 | TVS2.C 20,54.34
  Bottom 0.508: IC2.7 19.04,58.29 X10.3
N$24
  Top 1.016: C15.2 27.29,58.93 X10.4
  Bottom 1.016: X10.4 FS1.1
N$26
  Bottom 0.254: R15.1 111.78,56.29 TVS3.C
  Bottom 0.508: X4.1 TVS3.C
N$28
  Bottom 0.254: R16.1 116.86,56.29 TVS4.C
  Bottom 0.508: X4.2 TVS4.C
N$30
  Bottom 0.508: R17.1 X4.3
N$31  (via drill 0.4)
  Top 0.254: R30.1 25.07,42.01 25.07,44.01 26.97,45.91 28.24,45.91 28.88,46.54 28.88,52.9 29.2,53.21 v29.2,54.16
  Bottom 0.254: D10.A 30.04,56.28 29.2,55.43 v29.2,54.16
  Bottom 1.016: X9.1 D10.A
N$32
  Bottom 0.254: R18.1 102.26,10.8 TVS5.C X7.1
N$33
  Bottom 0.254: X7.2 TVS6.C 97.18,10.8 R19.1
N$34
  Bottom 0.254: X7.3 R20.1
N$35  (via drill 0.4)
  Top 0.254: OK2.3 v100.95,12.57
  Bottom 0.254: R18.2 101.05,12.47 v100.95,12.57
N$36
  Bottom 0.254: R21.1 60.35,56.29 TVS7.C
  Bottom 0.508: X1.1 TVS7.C
N$39  (via drill 0.4)
  Top 0.254: OK3.3 v64.12,54.48
  Bottom 0.254: R21.2 64.02,54.59 v64.12,54.48
N$40
  Bottom 0.254: R24.1 65.43,56.29 TVS8.C
  Bottom 0.508: X1.2 TVS8.C
N$41
  Bottom 0.508: X1.3 R25.1
N$42
  Bottom 0.254: R26.1 67.97,10.8 TVS9.C
  Bottom 0.508: X5.1 TVS9.C
N$43
  Bottom 0.254: R27.1 62.89,10.8 TVS10.C
  Bottom 0.508: X5.2 TVS10.C
N$44
  Bottom 0.508: X5.3 R31.1
N$45
  Bottom 0.254: R32.1 119.4,10.8 TVS11.C
  Bottom 0.508: X8.1 TVS11.C
N$46
  Bottom 0.254: R36.1 114.32,10.8 TVS12.C
  Bottom 0.508: X8.2 TVS12.C
N$47
  Bottom 0.508: X8.3 R37.1
N$48
  Bottom 0.254: R38.1 97.14,56.39 97,56.25 TVS13.C
  Bottom 0.508: X3.1 TVS13.C
N$49
  Bottom 0.254: R39.1 102.19,56.25 TVS14.C
  Bottom 0.508: X3.2 TVS14.C
N$50
  Bottom 0.508: X3.3 R42.1
N$51
  Bottom 0.254: R43.1 77.49,56.29 TVS15.C
  Bottom 0.508: X2.1 TVS15.C
N$52
  Bottom 0.254: R44.1 82.57,56.29 TVS16.C
  Bottom 0.508: X2.2 TVS16.C
N$53
  Bottom 0.508: X2.3 R45.1
N$54
  Bottom 0.254: R46.1 85.11,10.8 TVS17.C
  Bottom 0.508: X6.1 TVS17.C
N$55
  Bottom 0.254: R47.1 80.03,10.8 TVS18.C
  Bottom 0.508: X6.2 TVS18.C
N$56
  Bottom 0.508: X6.3 R48.1
N$57  (via drill 0.4)
  Top 0.254: OK4.3 v66.66,12.57
  Bottom 0.254: R26.2 66.77,12.47 v66.66,12.57
N$58  (via drill 0.4)
  Top 0.254: OK5.3 v118.1,12.57
  Bottom 0.254: R32.2 118.2,12.47 v118.1,12.57
N$59  (via drill 0.4)
  Top 0.254: OK6.3 v98.41,54.48
  Bottom 0.254: R38.2 97.25,54.48 v98.41,54.48
N$60  (via drill 0.4)
  Top 0.254: OK7.3 v81.27,54.48
  Bottom 0.254: R43.2 81.16,54.59 v81.27,54.48
N$62  (via drill 0.4)
  Top 0.254: OK8.3 v83.81,12.57
  Bottom 0.254: R46.2 83.91,12.47 v83.81,12.57
N$63  (via drill 0.4)
  Top 1.016: IC3.4 54.92,60.52 v57.77,57.66 59.68,55.75 v73.01,55.75 v90.16,55.75 v107.3,55.75 v124.45,55.75 124.45,11.3 v109.21,11.3 v92.06,11.3 v74.92,11.3 62.85,11.3 v60.31,13.84
  Bottom 0.254: R42.2 106.14,54.59 v107.3,55.75 | R17.2 123.28,54.59 v124.45,55.75 | R45.2 88.99,54.59 v90.16,55.75 | R48.2 76.08,12.47 v74.92,11.3 | R20.2 93.23,12.47 v92.06,11.3 | R37.2 110.38,12.47 v109.21,11.3 | R25.2 71.85,54.59 v73.01,55.75 | R31.2 v60.31,13.84 | R65.1 v57.77,57.66
  Bottom 0.508: C16.1 51.55,60.65 IC3.4
N$65  (via drill 0.4)
  Top 0.254: OK1.1 119.23,53.08 v119.37,53.21
  Bottom 0.254: R16.2 v119.37,53.21
N$66  (via drill 0.4)
  Top 0.254: OK2.1 97.28,13.98 v97.14,13.84
  Bottom 0.254: R19.2 v97.14,13.84
N$67  (via drill 0.4)
  Top 0.254: OK3.1 67.8,53.08 v67.93,53.21
  Bottom 0.254: R24.2 v67.93,53.21
N$69  (via drill 0.4)
  Top 0.254: OK4.1 62.99,13.98 v62.85,13.84
  Bottom 0.254: R27.2 v62.85,13.84
N$70  (via drill 0.4)
  Top 0.254: OK5.1 114.42,13.98 v114.29,13.84
  Bottom 0.254: R36.2 v114.29,13.84
N$71  (via drill 0.4)
  Top 0.254: OK6.1 102.09,53.08 v102.22,53.21
  Bottom 0.254: R39.2 v102.22,53.21
N$72  (via drill 0.4)
  Top 0.254: OK7.1 84.94,53.08 v85.08,53.21
  Bottom 0.254: R44.2 v85.08,53.21
N$73  (via drill 0.4)
  Top 0.254: OK8.1 80.13,13.98 v80,13.84
  Bottom 0.254: R47.2 v80,13.84
N$74  (via drill 0.4)
  Top 0.254: OK6.2 v99.68,51.62 97.46,51.62 97.14,51.94 OK6.4 | OK1.2 v116.83,51.62 114.61,51.62 114.29,51.94 OK1.4 | OK7.2 v82.54,51.62 80.31,51.62 80,51.94 OK7.4 | OK3.2 v65.39,51.62 63.17,51.62 62.85,51.94 OK3.4 | OK9.2 v59.04,51.62 | OK4.2 v65.39,15.43 67.61,15.43 67.93,15.11 OK4.4 | OK2.2 v99.68,15.43 101.91,15.43 102.22,15.11 OK2.4 | OK8.2 v82.54,15.43 84.76,15.43 85.08,15.11 OK8.4 | OK5.2 v116.83,15.43 | OK5.4 119.37,15.43
  Top 0.508: v116.83,15.43 119.37,15.43 122.54,15.43 | 122.54,51.62 v116.83,51.62
  Top 1.016: 122.54,15.43 122.54,51.62
  Bottom 0.254: TVS14.A v99.68,51.62 | TVS4.A v116.83,51.62 | TVS3.A 111.75,51.62 | 60.31,51.62 TVS7.A | TVS15.A 77.46,51.62 | TVS16.A v82.54,51.62 | TVS13.A 94.6,51.62 | TVS8.A v65.39,51.62 | TVS10.A v65.39,15.43 | TVS9.A 70.47,15.43 | TVS11.A 121.91,15.43 | TVS12.A v116.83,15.43 | TVS5.A 104.76,15.43 | TVS17.A 87.62,15.43 | TVS18.A v82.54,15.43 | TVS6.A v99.68,15.43
  Bottom 0.508: v116.83,51.62 111.75,51.62 v99.68,51.62 94.6,51.62 v82.54,51.62 77.46,51.62 v65.39,51.62 60.31,51.62 v59.04,51.62 57.45,51.62 55.87,53.21 55.87,56.26 C16.2 54.15,57.97 IC3.3 | v65.39,15.43 70.47,15.43 v82.54,15.43 87.62,15.43 v99.68,15.43 104.76,15.43 v116.83,15.43 121.91,15.43
N$75
  Top 0.254: R22.1 34.28,50.04 35.07,50.83 LED1.C
N$93  (via drill 0.4)
  Top 0.254: OK9.1 60.31,54.16 59.68,54.8 v59.04,54.8
  Bottom 0.254: R65.2 58.83,54.59 v59.04,54.8
N$95
  Bottom 0.254: Q1.1 R67.1
N$98
  Bottom 0.508: IC3.1 51.29,52.77 C18.1 48.25,51.48 Q1.3
N$99
  Bottom 0.508: FB2.1 48.23,55.59 C18.2 51.29,55.57 IC3.2
N$116  (via drill 0.4)
  Top 0.254: A0.2
  Bottom 0.254: IC5.15 38.09,36.7 A0.2
  other vias: 37.45,36.07
N$117  (via drill 0.4)
  Top 0.254: v39.36,36.07
  Bottom 0.254: IC5.16 v39.36,36.07
N$118  (via drill 0.4)
  Top 0.254: A2.2
  Bottom 0.254: IC5.17 40.63,36.7 A2.2
  other vias: 41.26,36.07
N$119
  Top 0.254: LED2.C R23.1
OPT-EN  (via drill 0.4)
  Top 0.254: U2.41 33.13,31.5 33.64,30.99 35.55,30.99 36.18,31.62 36.18,38.29 37.13,39.24 37.13,46.54 v36.5,47.18
  Bottom 0.254: R68.2 R67.2 v36.5,47.18
OPT-V+  (via drill 0.4)
  Top 0.254: OK9.7 R66.1 57.03,44.54 56.82,44.32 56.82,37.34 v57.14,37.02 | U2.38 31.78,30 32.69,29.08 36.82,29.08 v38.09,30.35
  Bottom 0.254: v57.14,37.02 56.5,36.39 52.38,36.39 47.61,31.62 43.17,31.62 41.58,30.04 38.41,30.04 v38.09,30.35
PA06  (via drill 0.41)
  Top 0.254: v13.01,31.31 17.45,31.31 18.4,32.26 18.4,32.89 v20.31,34.8
  Bottom 0.254: X0.7 9.83,31.62 12.69,31.62 v13.01,31.31 | R71.1 R70.1 20.31,35.22 v20.31,34.8
PA07
  Top 0.254: U2.26 24.4,26.19 23.8,25.59 18.72,25.59 17.45,26.86 17.45,28.45 16.81,29.08 14.91,29.08 14.38,28.55 R72.2 X0.12
PWR-EN
  Top 0.254: IC6.5 22.28,22.61 22.28,22.04 22.53,21.78 24.24,21.78 24.78,22.31 R14.1 25.7,23.37 26.5,24.16 26.5,25.11 25.41,26.2 U2.28
RED
  Top 0.254: R22.2 34.28,45.91 35.55,44.64 35.55,39.88 34.91,39.24 34.91,34.8 33.62,33.5 U2.45
RESET  (via drill 0.4)
  Top 0.254: U2.7 26.4,37.72 26.66,37.97 27.93,37.97 v28.24,38.29
  Bottom 0.254: R8.1 C1.2 | v28.24,38.29 28.24,38.93 27.93,39.24 C1.2 | C1.2 R28.2
RX  (via drill 0.4)
  Top 0.254: U2.31 26.91,31.69 v25.7,32.89 | R2.1 17.13,32.26 v17.45,32.58
  Bottom 0.254: v25.7,32.89 25.39,32.58 v17.45,32.58
SCL  (via drill 0.4)
  Top 0.254: v35.23,31.94 34.91,31.62 33.96,31.62 33.58,32 U2.42 28.5,32 v26.97,33.53 | v12.62,33.84 v18.08,33.84 | IC7.5 41.58,25.75 v41.26,25.43
  Bottom 0.254: I2C.2 5.39,35.43 X0.5 9.2,35.43 10.46,34.16 12.31,34.16 v12.62,33.84 12.94,34.16 R6.1 | v26.97,33.53 26.66,33.84 25.39,33.84 24.75,33.21 19.67,33.21 19.04,33.84 v18.08,33.84 | v35.23,31.94 34.91,31.62 34.91,30.35 35.86,29.4 40.31,29.4 40.63,29.08 IC5.12 40.63,26.07 v41.26,25.43
SDA  (via drill 0.4)
  Top 0.254: v34.28,32.58 34.21,32.51 U2.43 28.94,32.51 27.93,33.53 v27.93,34.16 | IC7.4 39.68,25.75 v39.36,25.43 | v19.04,34.8 18.84,34.99 v13.2,34.99
  Bottom 0.254: X0.3 9.83,36.7 11.54,36.7 12.18,36.07 13.07,36.07 | 8.5,37.97 X0.3 | R7.1 13.07,36.07 | v13.2,34.99 13.2,35.94 13.07,36.07 | IC5.13 v39.36,25.43 37.61,25.43 34.28,28.77 v34.28,32.58 | I2C.1 5.39,37.97 X0.3 | v27.93,34.16 27.61,34.48 25.07,34.48 24.44,33.84 19.99,33.84 v19.04,34.8
SWCKL
  Top 0.254: U2.37 31.31,29.52 31.42,29.4 31.42,26.86 31.74,26.54 33.33,26.54 36.18,23.69 36.18,14.79 37.13,13.84 38.72,13.84 SWD.3
SWDIO
  Top 0.254: U2.34 28.41,29.25 28.56,29.4 29.51,29.4 30.78,28.13 30.78,26.54 31.42,25.91 33.01,25.91 35.55,23.37 35.55,14.16 37.13,12.57 SWD.2
TX  (via drill 0.4)
  Top 0.254: U2.30 26.4,31.24 26.02,31.62 v25.7,31.62 | R1.1 v17.45,30.35
  Bottom 0.254: v17.45,30.35 17.45,30.99 18.4,31.94 25.39,31.94 v25.7,31.62
VCC  (via drill 0.4)
  Top 0.254: U2.24 21.69,29.52 21.26,29.08 v21.26,27.18 | U2.36 29.4,27.29 29.83,26.86 v29.83,25.27 28.56,25.27 28.24,24.96 28.24,21.78 27.08,20.61 R14.2 | U2.48 32.89,35 v33.33,35.43 33.22,35.54 | LED1.A LED2.A 31.58,54.33 30.78,53.53 v30.78,45.28 33.01,45.28 34.28,44.01 34.28,40.51 33.96,40.2 FB1.1 33.01,39.88 33.22,39.66 | A0.1 39.25,34.27 v39.36,34.16 39.46,34.27 | A2.1 39.46,34.27 | 39.46,34.27 A1.1
  Top 0.508: 33.22,39.66 C3.1 33.22,35.54 | SWD.1 34.91,22.73 v33.01,24.64 32.37,25.27 v29.83,25.27
  Bottom 0.254: 26.53,29.47 C23.+ | R41.2 20.59,27.54 20.94,27.18 v21.26,27.18 | v39.36,34.16 39.04,34.48 34.28,34.48 v33.33,35.43 | R8.2 29.83,42.73 30.78,43.69 v30.78,45.28
  Bottom 0.508: IC4.1 18.21,24.26 22.25,24.26 C17.2 22.31,26.12 22.21,26.23 | 26.66,26.23 22.21,26.23 | 22.21,26.23 v21.26,27.18 | v33.33,35.43 32.37,34.48 32.37,25.27 v33.01,24.64 | 26.66,26.23 27.61,25.27 v29.83,25.27 | C23.+ 26.6,26.29 26.66,26.23
VDDA
  Top 0.254: FB1.2 33.01,41.78 32.06,41.78 31.74,41.47 31.74,40.51 31.52,40.3 C2.1 30.78,39.24 29.51,39.24 | U2.1 29.4,39.13 29.51,39.24 | U2.9 25.41,38 26.02,38.61 26.97,38.61 27.61,39.24 29.51,39.24
X1.1  (via drill 0.4)
  Top 0.254: OK3.5 v62.85,45.91 R53.1
  Bottom 0.254: IC5.21 45.71,38.29 50.15,42.73 62.53,42.73 62.85,43.05 v62.85,45.91
X1.2  (via drill 0.4)
  Top 0.254: OK3.7 v65.39,45.91 R54.1
  Bottom 0.254: IC5.22 46.98,38.29 50.79,42.1 65.07,42.1 65.39,42.42 v65.39,45.91
X2.1  (via drill 0.4)
  Top 0.254: OK7.5 v80,45.91 R61.1
  Bottom 0.254: IC5.23 48.25,38.29 51.42,41.47 79.36,41.47 80,42.1 v80,45.91
X2.2  (via drill 0.4)
  Top 0.254: OK7.7 v82.54,45.91 R62.1
  Bottom 0.254: IC5.24 49.52,38.29 52.06,40.83 81.9,40.83 82.54,41.47 v82.54,45.91
X3.1  (via drill 0.4)
  Top 0.254: OK6.5 v97.14,45.91 R59.1
  Bottom 0.254: IC5.25 50.79,38.29 52.69,40.2 95.87,40.2 97.14,41.47 v97.14,45.91
X3.2  (via drill 0.4)
  Top 0.254: OK6.7 v99.68,45.91 R60.1
  Bottom 0.254: IC5.26 52.06,38.29 53.33,39.56 97.78,39.56 99.68,41.47 v99.68,45.91
X4.1  (via drill 0.4)
  Top 0.254: OK1.5 v114.29,45.91 R49.1
  Bottom 0.254: IC5.27 53.33,38.29 53.96,38.93 111.75,38.93 114.29,41.47 v114.29,45.91
X4.2  (via drill 0.4)
  Top 0.254: OK1.7 v116.83,45.91 R50.1
  Bottom 0.254: v116.83,45.91 116.83,41.78 113.33,38.29 55.23,38.29 IC5.28
X5.1  (via drill 0.4)
  Top 0.254: R55.1 v67.93,21.15 OK4.5
  Bottom 0.254: IC5.7 46.98,27.5 50.79,23.69 66.35,23.69 67.93,22.1 v67.93,21.15
X5.2  (via drill 0.4)
  Top 0.254: R56.1 v65.39,21.15 OK4.7
  Bottom 0.254: IC5.8 45.71,27.5 50.15,23.05 64.44,23.05 65.39,22.1 v65.39,21.15
X6.1  (via drill 0.4)
  Top 0.254: R63.1 v85.08,21.15 OK8.5
  Bottom 0.254: IC5.5 49.52,27.5 52.06,24.96 83.81,24.96 85.08,23.69 v85.08,21.15
X6.2  (via drill 0.4)
  Top 0.254: R64.1 v82.54,21.15 OK8.7
  Bottom 0.254: IC5.6 48.25,27.5 51.42,24.32 81.9,24.32 82.54,23.69 v82.54,21.15
X7.1  (via drill 0.4)
  Top 0.254: R51.1 v102.22,21.15 OK2.5
  Bottom 0.254: IC5.3 52.06,27.5 53.33,26.23 100.32,26.23 102.22,24.32 v102.22,21.15
X7.2  (via drill 0.4)
  Top 0.254: R52.1 v99.68,21.15 OK2.7
  Bottom 0.254: IC5.4 50.79,27.5 52.69,25.59 98.41,25.59 99.68,24.32 v99.68,21.15
X8.1  (via drill 0.4)
  Top 0.254: OK5.5 v119.37,21.15 R57.1
  Bottom 0.254: IC5.1 54.6,28.13 55.23,27.5 116.19,27.5 119.37,24.32 v119.37,21.15
X8.2  (via drill 0.4)
  Top 0.254: OK5.7 v116.83,21.15 R58.1
  Bottom 0.254: IC5.2 53.33,27.5 53.96,26.86 114.29,26.86 116.83,24.32 v116.83,21.15
Z3V3  (via drill 0.4)
  Top 0.254: 60.31,49.09 OK9.8 60.31,45.91 60.95,45.28 R69.1 | 118.1,49.09 OK1.8 | OK1.6 115.56,49.09 | OK6.8 100.95,49.09 | OK6.6 98.41,49.09 | OK7.8 83.81,49.09 | OK7.6 81.27,49.09 | OK3.8 66.66,49.09 | OK3.6 64.12,49.09 | OK5.6 118.1,17.97 | 64.12,17.97 OK4.8 | OK4.6 66.66,17.97 | OK8.8 81.27,17.97 | OK8.6 83.81,17.97 | OK2.8 98.41,17.97 | OK2.6 100.95,17.97 | OK5.8 115.56,17.97 | IC7.1 41.58,30.35 41.9,30.67 43.49,30.67 v44.12,30.04 | R72.1 16.18,27.71 v16.18,26.54
  Top 0.508: 60.31,49.09 64.12,49.09 66.66,49.09 67.93,49.09 | 67.93,49.09 81.27,49.09 83.81,49.09 98.41,49.09 100.95,49.09 115.56,49.09 118.1,49.09 | 118.1,17.97 115.56,17.97 100.95,17.97 98.41,17.97 83.81,17.97 81.27,17.97 66.66,17.97 64.12,17.97 63.49,17.97 61.58,19.88 v61.58,21.46 61.58,34.8 67.93,41.15 67.93,49.09 | v16.18,26.54 16.81,26.54 18.4,24.96 25.39,24.96 v25.7,24.64
  Bottom 0.254: C19.1 44.44,23.37
  Bottom 0.508: 16.05,29.08 16.05,31.62 R4.1 16.05,31.75 16.05,34.16 R6.2 16.05,34.29 16.05,36.7 R7.2 16.05,36.83 14.4,38.48 14.4,39.24 R34.2 | 16.05,29.08 R3.1 | X0.17 8.56,20.83 9.83,22.1 9.83,23.37 10.46,24 11.99,24 14.53,26.54 16.05,26.54 | 9.2,40.51 X0.1 | 9.2,40.51 10.46,39.24 R34.2 | 16.05,29.08 16.05,26.54 | IC2.8 20.41,56.39 20.94,56.39 21.58,55.75 21.58,54.16 20.63,53.21 16.5,53.21 15.54,52.26 C7.2 13.96,50.67 14.28,50.35 C6.2 12.05,43.37 9.2,40.51 | 14.28,39.34 R34.2 | v44.12,30.04 44.44,29.72 IC5.9 44.44,23.47 C19.1 | v16.18,26.54 16.05,26.54 | 44.44,21.46 27.93,21.46 25.7,23.69 v25.7,24.64 | 44.44,21.46 v61.58,21.46 | 44.44,23.37 44.44,21.46
Z5V
  Top 0.508: X0.2 X0.4 | 14.28,37.97 14.28,41.15 R5.2 | 14.28,37.97 C14.+ 14.15,37.85 | X0.4 9.83,36.7 9.83,22.1 10.46,21.46 12.56,21.46 12.87,21.15 C9.2 R11.1 | 14.28,37.97 X0.4
  Top 1.016: C9.2 14.28,16.7 | C22.2 14.28,16.7 | 14.28,16.7 L4.7.P$2
ZRX
  Top 0.254: 14.4,30.35 R3.2 X0.10
  Bottom 0.254: UART.2 4.12,29.08 9.83,29.08 X0.10 R3.2
ZTX
  Top 0.254: R4.2 11.73,32.26 X0.8
  Bottom 0.254: R4.2 11.73,32.26 X0.8 10.46,32.89 9.2,34.16 6.66,34.16 UART.1

### Text on the board
Top: TOP
Bottom: BOTTOM
tNames: + | H2.2 | SDA | SCL | GND | 0 / / 1 | RX | TX | GR | 0 2 1 | 0 2 1 | 0 2 1 | 0 2 1
bNames: 12V B A GND | - PS A | 0 2 1 | 0 2 1 | 0 2 1 | 0 2 1 | VCC | SWDIO | SWCLK | GND | 1 2 0 | 1 2 0 | 1 2 0 | 1 2 0